# Altium project EFNMR_PROCESSOR_V1.PrjPcb
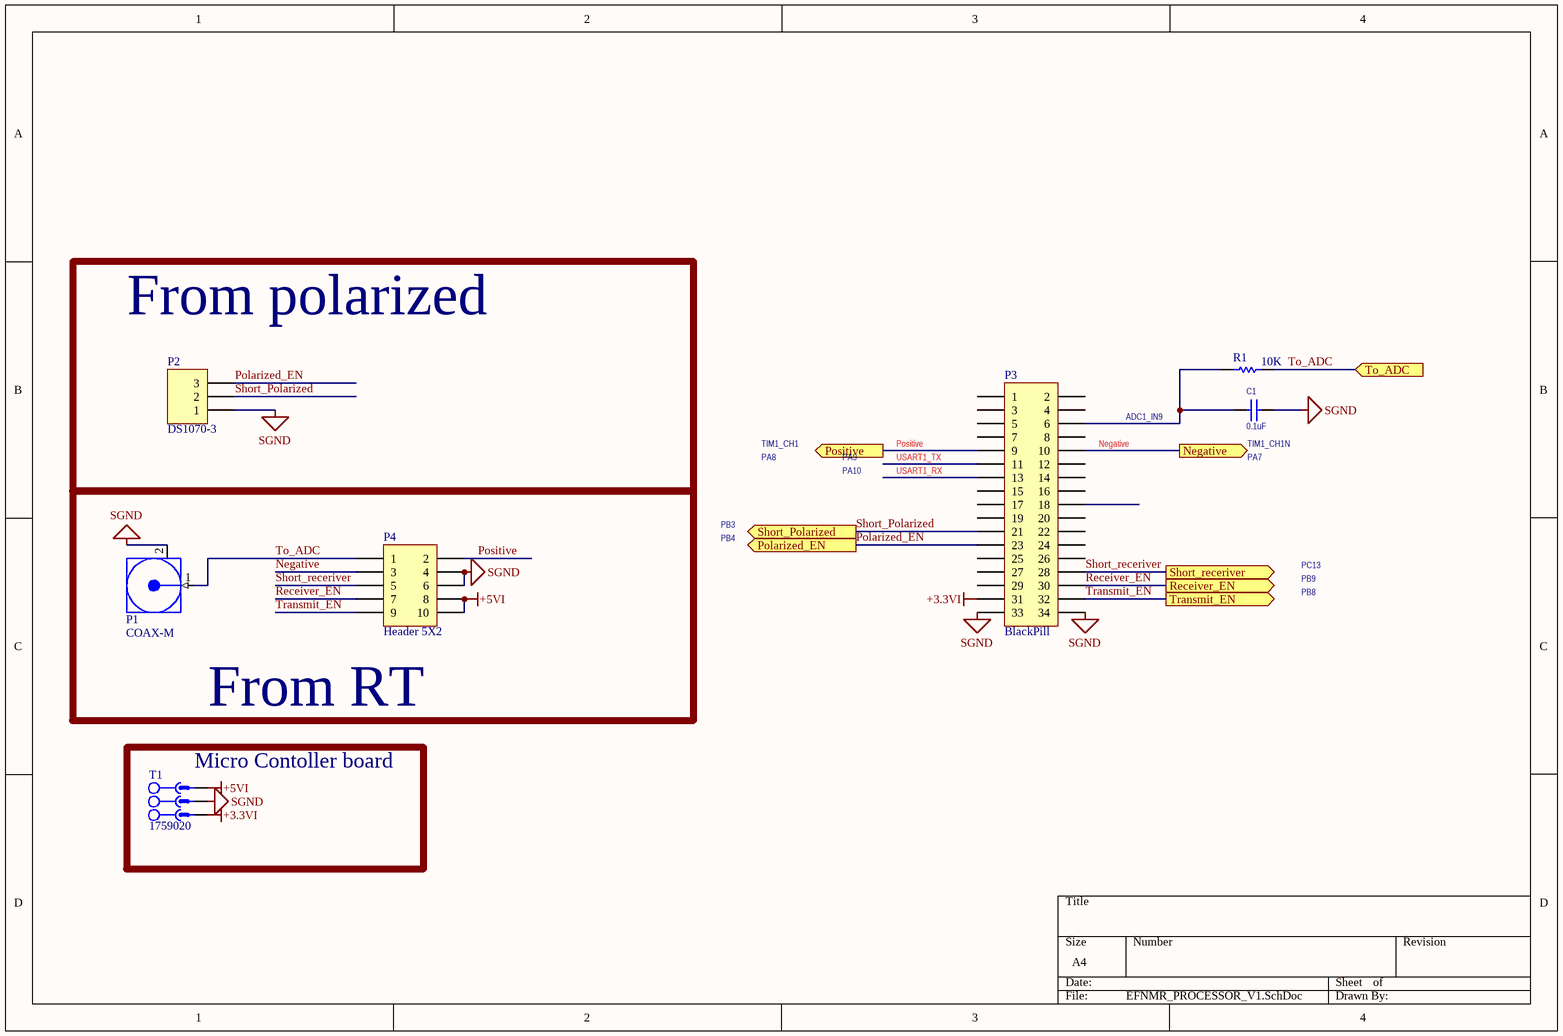
[diagram p0: EFNMR_PROCESSOR_V1.SchDoc]
1 sheet, 7 parts. Net scope: flat (ports and power ports of the same name join across sheets).
Board file: EFNMR_PROCESSOR_V1.PcbDoc

## Sheet EFNMR_PROCESSOR_V1.SchDoc
size A4

### Parts
C1  0.1uF  [CAP0805]
P1  COAX-M  [SMA_RA_F]
P2  DS1070-3  [DS1070-3-COMCON]
P3  BlackPill  [BlackPill]
P4  Header 5X2  [IDC2.54-10PIN WITH CABLE]
R1  10K  [RES0805]
T1  1759020  [MSTB 2,5/3-G-5,08]

### Blocks framed on the sheet
From polarized: P2
From RT: P1 P4
Micro Contoller board: T1

### Ports
Negative (out), Polarized_EN (out), Positive (out), Receiver_EN (out), Short_Polarized (out), Short_receriver (out), To_ADC (in), Transmit_EN (out)

### Nets
+3.3VI: P3.31 T1.1
+5VI: P4.8 P4.10 T1.3
SGND: C1.2 P1.2(GND) P2.1 P3.33 P3.34 P4.4 P4.6 T1.2
Negative: P3.10 P4.3 ; port Negative
Polarized_EN: P2.3 P3.23 ; port Polarized_EN
Positive: P3.9 P4.2 ; port Positive
Receiver_EN: P3.30 P4.7 ; port Receiver_EN
Short_Polarized: P2.2 P3.21 ; port Short_Polarized
Short_receriver: P3.28 P4.5 ; port Short_receriver
To_ADC: P1.1(Signal) P4.1 R1.2 ; port To_ADC
Transmit_EN: P3.32 P4.9 ; port Transmit_EN
USART1_RX: P3.13
USART1_TX: P3.11
NetC1_1: C1.1 P3.6 R1.1

Not connected (* = marked no-connect by the designer): P3 1 2 3 4 5 7 8 12 14 15 16 17 18 19 20 22 24 25 26 27 29

### Notes on the sheet
- TIM1_CH1
- ADC1_IN9
- (near C1) TIM1_CH1N
- PA8
- PA9
- PA10
- (near C1) PA7
- PB3
- PB4
- PC13
- PB9
- PB8

### Library data of the parts
C1 = CAP SMD 0805: CAP 0805; Designer: Abbas Basereh; Desc.: CAP SMD 0805; Data: 16-12-2016
P1 = COAX-M: RF Coaxial PCB Connector, MMCX; Thru-Hole, Vertical Mount Plug,  50 Ohm Impedance; PackageDocument: Rev. A, 16-Jun-1997; PCB_Layout: Complies with manufacturer's recommendation.; DrillSize: Corresponds to nominal value.; Published: 15-Jul-2004; LatestRevisionDate: 15-Jul-2004; LatestRevisionNote: Component Replaced.; DatasheetDocument: 30-May-2003; PackageReference: 908-21103; Publisher: Altium Limited; ComponentLink1Description: Manufacturer Link; ComponentLink1URL: http://www.amphenolrf.com/
P2 = Header 3: Header, 3-Pin; LatestRevisionDate: 17-Jul-2002; LatestRevisionNote: Re-released for DXP Platform.; Publisher: Altium Limited
P3 = Header 17X2: Header, 17-Pin, Dual row; LatestRevisionDate: 17-Jul-2002; LatestRevisionNote: Re-released for DXP Platform.; Publisher: Altium Limited
P4 = Header 5X2: Header, 5-Pin, Dual row; LatestRevisionDate: 17-Jul-2002; LatestRevisionNote: Re-released for DXP Platform.; Publisher: Altium Limited
R1 = Res1: Resistor; Published: 8-Jun-2000; LatestRevisionDate: 17-Jul-2002; LatestRevisionNote: Re-released for DXP Platform.; PackageReference: AXIAL-0.3; Publisher: Altium Limited; PackageDescription: Axial Device, Thru-Hole; 2 Leads; 0.3 in Pin Spacing; Value: 10K
T1 = CON_Phoenix_MSTB_03: 3 Pitch: 5.08 mm Color: green Contact surface: Tin Assembly; Manufacturer: PHOENIX CONTACT; Connector type: PCB Terminal Block; designer: ABBAS BASEREH; Max Current: 12 A; Positions: 3; Voltage: 320 V; Category: Connector; ComponentLink1Description: Header, Nominal current: 12 A Rated voltage (III/2): 320 V Number of positions: 3 Pitch: 5.08 mm Color: green Contact surface: Tin Assembly: Soldering  DESIGNER:ABBAS BASEREH; ComponentLink2Description: Reference; Mounting Technology: Through-Hole; Pin Count: 3; Revision 1: 2017-3-1; Status: Unreleased; PART.NO: 1759020